# Altium schematic sheet AphelionGroundStation.SchDoc
size A4
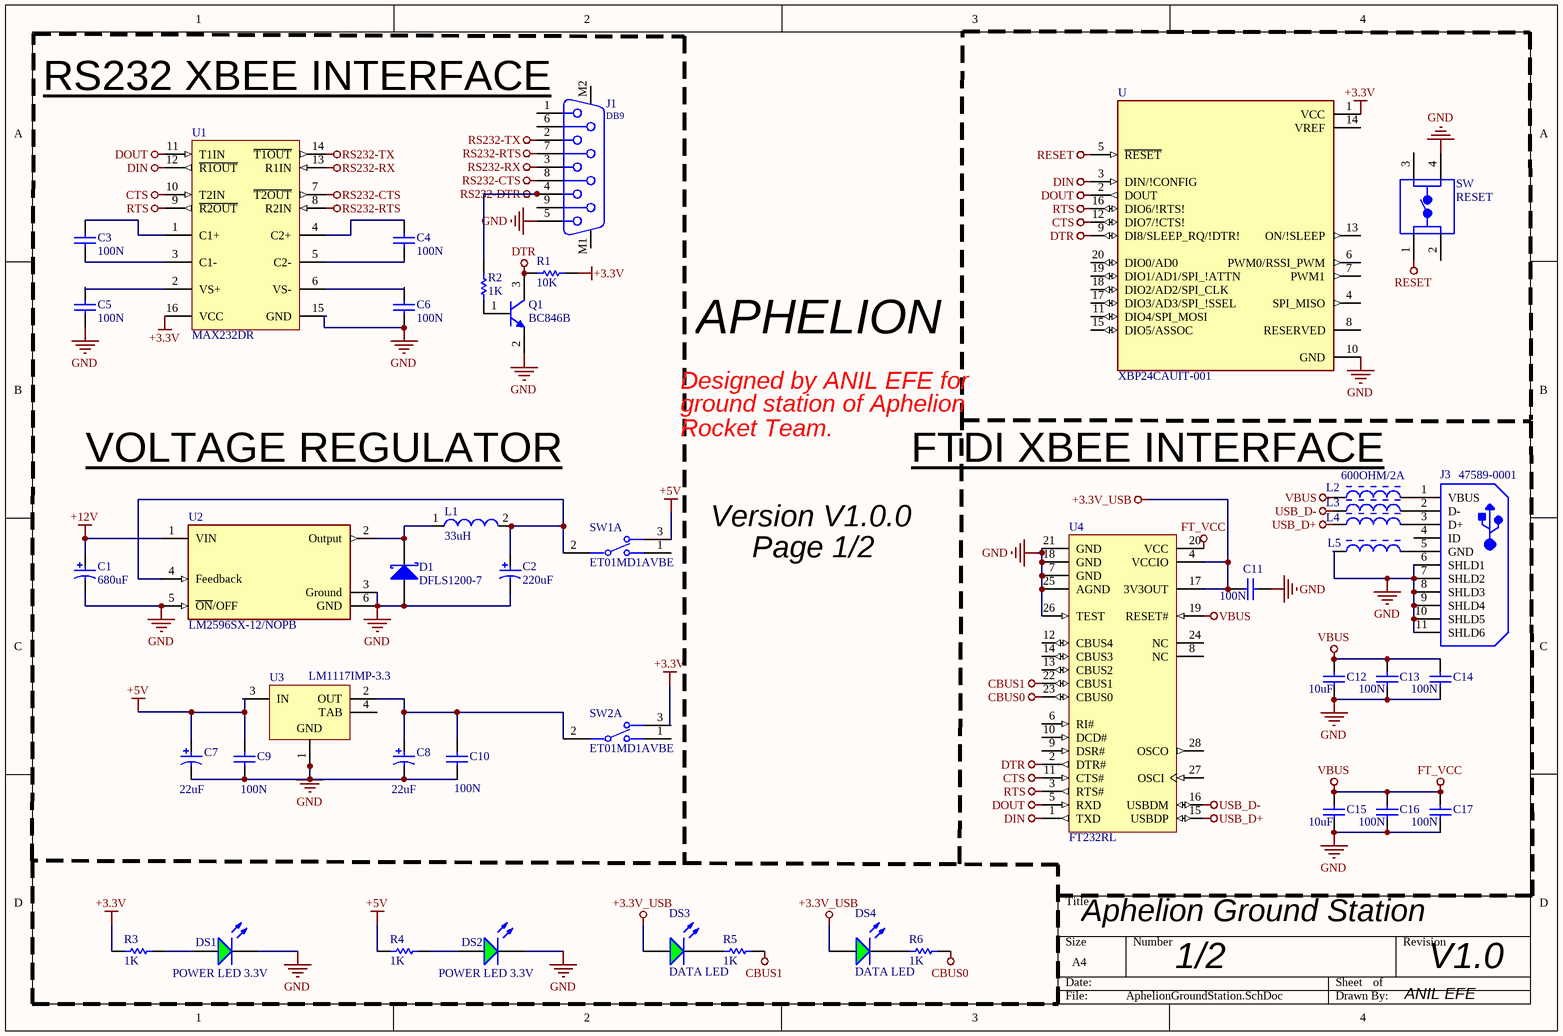
[diagram p0: AphelionGroundStation.SchDoc]

## Parts
C1  680uF  [PNSC-FT-V-G_V]
C2  220uF  [PNSC-FP-V-F_V]
C3  100N  [KEMT-1206-2_M]
C4  100N  [KEMT-1206-2_M]
C5  100N  [KEMT-1206-2_M]
C6  100N  [KEMT-1206-2_M]
C7  22uF  [KEMT-T491-D_L]
C8  22uF  [KEMT-T491-D_L]
C9  100N  [KEMT-1206-2_M]
C10  100N  [KEMT-1206-2_M]
C11  100N  [KEMT-1206-2_M]
C12  10uF  [KEMT-1206-2_M]
C13  100N  [KEMT-1206-2_M]
C14  100N  [KEMT-1206-2_M]
C15  10uF  [KEMT-1206-2_M]
C16  100N  [KEMT-1206-2_M]
C17  100N  [KEMT-1206-2_M]
D1  DFLS1200-7  [DIOD-POWERDI123-2_A_V]
DS1  POWER LED 3.3V  [KING-APTD3216CGCK_V]
DS2  POWER LED 3.3V  [KING-APTD3216CGCK_V]
DS3  DATA LED  [KING-APTD3216CGCK_V]
DS4  DATA LED  [KING-APTD3216CGCK_V]
J1  DB9  [618009231321]
J3  47589-0001  [MOLX-47589-0001_V]
L1  33uH  [WE-PD 1050]
L2  600OHM/2A  [MURA-BLM31A_L]
L3  600OHM/2A  [MURA-BLM31A_L]  (value not drawn)
L4  600OHM/2A  [MURA-BLM31A_L]  (value not drawn)
L5  600OHM/2A  [MURA-BLM31A_L]  (value not drawn)
Q1  BC846B  [ONSC-SOT-23-3-318-08_V]
R1  10K  [RESC3216X60X45LL10T20]
R2  1K  [RESC3216X60X45LL10T20]
R3  1K  [RESC3216X60X45LL10T20]
R4  1K  [RESC3216X60X45LL10T20]
R5  1K  [RESC3216X60X45LL10T20]
R6  1K  [RESC3216X60X45LL10T20]
SW  RESET  [TE_3-1825910-1]
SW1  ET01MD1AVBE  [FP-ET01MD1AVBE-MFG]  (part A of 2)
SW2  ET01MD1AVBE  [FP-ET01MD1AVBE-MFG]  (part A of 2)
U  XBP24CAUIT-001  [MODULE_XBP24CAUIT-001]
U1  MAX232DR  [D0016A_L]
U2  LM2596SX-12/NOPB  [FP-KTT0005B-MFG]
U3  LM1117IMP-3.3  [DCY0004A_N]
U4  FT232RL  [FTDI-SSOP-28_M]

## Nets
+3.3V: R1.2 R3.1 SW2.3 U.1(VCC) U1.16(VCC)
+3.3V_USB: C11.2 DS3.1(A) DS4.1(A) U4.4(VCCIO) U4.17(3V3OUT)
+5V: C7.1 C9.2 R4.1 SW1.3 U3.3(IN)
+12V: C1.1 U2.1(VIN)
CBUS0: R6.2 U4.23(CBUS0)
CBUS1: R5.2 U4.22(CBUS1)
CTS: U.12(DIO7/!CTS!) U1.10(T2IN) U4.11(CTS#)
DIN: U.3(DIN/!CONFIG) U1.12(~{R1OUT}) U4.1(TXD)
DOUT: U.2(DOUT) U1.11(T1IN) U4.5(RXD)
DTR: Q1.3(C) R1.1 U.9(DI8/SLEEP_RQ/!DTR!) U4.2(DTR#)
FT_VCC: C12.2 C13.2 C14.2 C15.2 C16.2 C17.2 L2.1 U4.19(RESET#) U4.20(VCC)  [also labelled VBUS]
GND: C1.2 C2.2 C5.2 C6.2 C7.2 C8.2 C9.1 C10.1 C11.1 C12.1 C13.1 C14.1 C15.1 C16.1 C17.1 D1.1(A) DS1.2(K) DS2.2(K) J1.5 J3.6(SHLD1) J3.7(SHLD2) J3.8(SHLD3) J3.9(SHLD4) J3.10(SHLD5) J3.11(SHLD6) L5.1 Q1.2(E) SW.4 U.10(GND) U1.15(GND) U2.3(Ground) U2.5(~{ON}/OFF) U2.6(GND) U3.1(GND) U4.7(GND) U4.18(GND) U4.21(GND) U4.25(AGND) U4.26(TEST)
RESET: SW.1 U.5(~{RESET})
RS232-CTS: J1.8 U1.7(~{T2OUT})
RS232-DTR: J1.4 R2.2
RS232-RTS: J1.7 U1.8(R2IN)
RS232-RX: J1.3 U1.13(R1IN)
RS232-TX: J1.2 U1.14(~{T1OUT})
RTS: U.16(DIO6/!RTS!) U1.9(~{R2OUT}) U4.3(RTS#)
USB_D+: L4.1 U4.15(USBDP)
USB_D-: L3.1 U4.16(USBDM)
NetC2_1: C2.1 L1.2 SW1.2(COM) U2.4(Feedback)
NetC3_1: C3.1 U1.3(C1-)
NetC3_2: C3.2 U1.1(C1+)
NetC4_1: C4.1 U1.5(C2-)
NetC4_2: C4.2 U1.4(C2+)
NetC5_1: C5.1 U1.2(VS+)
NetC6_1: C6.1 U1.6(VS-)
NetC8_1: C8.1 C10.2 SW2.2(COM) U3.2(OUT)
NetD1_2: D1.2(K) L1.1 U2.2(Output)
NetDS1_1: DS1.1(A) R3.2
NetDS2_1: DS2.1(A) R4.2
NetDS3_2: DS3.2(K) R5.1
NetDS4_2: DS4.2(K) R6.1
NetJ3_1: J3.1(VBUS) L2.2
NetJ3_2: J3.2(D-) L3.2
NetJ3_3: J3.3(D+) L4.2
NetJ3_5: J3.5(GND) L5.2
NetQ1_1: Q1.1(B) R2.1

Not connected (* = marked no-connect by the designer): J1 1 6 9 M1 M2; J3 4(ID); SW 2 3; SW1 1; SW2 1; U 4(SPI_MISO) 6(PWM0/RSSI_PWM) 7(PWM1) 8(RESERVED) 11(DIO4/SPI_MOSI) 13(ON/!SLEEP) 14(VREF) 15(DIO5/ASSOC) 17(DIO3/AD3/SPI_!SSEL) 18(DIO2/AD2/SPI_CLK) 19(DIO1/AD1/SPI_!ATTN) 20(DIO0/AD0); U3 4(TAB); U4 6(RI#) 8(NC) 9(DSR#) 10(DCD#) 12(CBUS4) 13(CBUS2) 14(CBUS3) 24(NC) 27(OSCI) 28(OSCO)

## Notes on the sheet
- RS232 XBEE INTERFACE
- APHELION
- Rocket Team.
- ground station of Aphelion
- Designed by ANIL EFE for
- VOLTAGE REGULATOR
- FTDI XBEE INTERFACE
- Version V1.0.0
- Page 1/2
- Aphelion Ground Station
- 1/2
- V1.0
- ANIL EFE

## Library data of the parts
C1 = CMP-2000-06218-1: Aluminum Electrolytic Capacitor, 560 uF, +/- 20%, 35 V, 2-Pin SMD (Size Code G), -55 to 105 degC, RoHS, Tape and Reel; Manufacturer: Panasonic; Rated Voltage: 35V; Ripple Current: 1190mA; ESR (Equivalent Series Resistance): 0.06O; Lifetime@Temperature: 2000Hrs@105°C; Capacitance: 560µF; Type: Can; Manufacturer URL: http://www.panasonic.com/; Package Reference: FT-V-G; Package URL: http://industrial.panasonic.com/cdbs/www-data/pdf/RDE0000/DME0000COL48.pdf; Datasheet Version: 03/2014; Mounting Technology: SurfaceMount; Operating Temp Range: -55to+105°C; Datasheet URL: http://industrial.panasonic.com/cdbs/www-data/pdf/RDE0000/ABA0000C35.pdf; Series: FT; Case Size/Dimension: Ø10x10.2mm; Operating Temp-Max: 105°C; Package Description: 2-Pin Electrolytic Aluminum Capacitor, Body 10.3 x 10.3 mm
C2 = CMP-2000-06215-1: Aluminum Electrolytic Capacitor, 220 uF, +/- 20%, 35 V, 2-Pin SMD (Size Code F), -55 to 105 degC, RoHS, Tape and Reel; Manufacturer: Panasonic; ESR: 0.08ohm; Ripple Current AC: 850mA; Capacitance: 220µF; External Length / Height: 10.2mm; SVHC: ToBeAdvised; Life Time @ Temperature: 2000hours@105°C; Voltage Rating: 35V; Capacitor Case Style: RadialCan-SMD; Leakage Current: 7.7µA; Product Range: PANASONIC-FPSeries; Diameter: 8mm; Datasheet URL: http://industrial.panasonic.com/cdbs/www-data/pdf/RDE0000/ABA0000C1184.pdf; Manufacturer URL: http://www.panasonic.com/; Series: FP; Operating Temperature Max: 105°C; Package Description: 2-Pin Electrolytic Aluminum Capacitor, Body 8.3 x 8.3 mm; Package Reference: FP-V-F; Lifetime @ Temperature: 2000hours@105°C; Operating Temperature Range: -55°Cto+105°C; Package URL: http://industrial.panasonic.com/cdbs/www-data/pdf/RDE0000/DME0000COL48.pdf; Capacitance Tolerance ±: ±20%; AE Capacitor Case: RadialCan-SMD; Height: 10.2mm; Mounting Technology: SurfaceMount; Datasheet Version: 03/2016; Packaging: CutTape; Operating Temperature Min: -55°C; Capacitance Tolerance: ±20%
C3-C6 C9-C17 = CMP-2000-05169-1: CAP, Ceramic, 0.1 uF, +/- 10%, 50 V, -55 to 125 degC, 1206 (3216 Metric), RoHS, Tape and Reel; Manufacturer: Kemet; Voltage Rating: 50V; Capacitance: 0.1µF; Product Range: KEMET-CSeries; SVHC: ToBeAdvised; Dielectric Characteristic: X7R; Capacitor Case Style: 1206[3216Metric]; Package Reference: 1206-2; Package Description: 2-Leads SMD, Body 3.2 x 1.6 mm; Packaging: Tape&Reel; Operating Temperature Max: 125degC; Capacitance Tolerance: ±10%; Datasheet URL: https://datasheet.ciiva.com/6125/1725438-6125494.pdf; Manufacturer URL: http://www.kemet.com/; Operating Temperature Min: -55degC; Datasheet Version: Jul-13
C7 C8 = CMP-2000-07201-1: Tantalum Surface Mount Capacitor, 22 uF, +/- 10%, 16 V, -55 to 125 degC, 2-Pin SMD, RoHS, Tape and Reel; Manufacturer: Kemet; Voltage Rating: 16V; ESR: 0.8ohm; Capacitance: 22µF; SVHC: –; Capacitor Case Style: 2917; Package Description: 2-Pin Surface Mount Device, Body 7.3 x 4.3 mm; Mounting Technology: SurfaceMount; Datasheet URL: http://www.kemet.com/Lists/ProductCatalog/Attachments/254/KEM_T2005_T491.pdf; Lead Spacing: –; Capacitor Terminals: SMD; Datasheet Version: 06/2016; Package Reference: T491-D; Manufacturer URL: http://www.kemet.com/; Capacitance Tolerance: ±10%; MSL: MSL1-Unlimited; Operating Temperature Range: -55°Cto+125°C
D1 = CMP-2000-07540-1: High Voltage Schottky Barrier Rectifier, 200 V, 1 A, -65 to 175 degC, 2-Pin SMD, RoHS, Tape and Reel; Manufacturer: Diodes Inc; Peak Non-Repetitive Surge Current: 40A; Max Repetitive Reverse Voltage (Vrrm): 200V; Peak Reverse Current: 2uA; Capacitance: 23pF; Forward Current: 1A; Forward Voltage: 850mV; Element Configuration: Single; Polarity: Standard; Number of Pins: 2; Package Description: 2-Pin Small Outline Diode, Body 2.8 x 1.78 mm; Mount: SurfaceMount; Max Operating Temperature: 150degC; Package Quantity: 3000; Lead Free: LeadFree; Max Forward Surge Current (Ifsm): 40A; Height: 0.98mm; Datasheet Version: Rev. 6-2, 10/2008; Package Reference: POWERDI123-2_A; Reverse Voltage (DC): 200V; REACH SVHC: NoSVHC; Min Operating Temperature: -65degC; RoHSCompliant: true; Width: 1.78mm; Contact Plating: Matte; Termination: SMD/SMT; Manufacturer URL: http://www.diodes.com/; Voltage Rating (DC): 200V; Length: 2.8mm; Output Current: 1A; Packaging: TapeandReel; Current Rating: 1A; Radiation Hardening: No; Mounting Technology: SurfaceMount; Average Rectified Current: 1A; Datasheet URL: https://www.diodes.com/assets/Datasheets/ds30628.pdf
DS1-DS4 = CMP-2000-05792-1: Chip LED Lamp, Green, 5 V, 30 mA, -40 to 85 degC, 2-Pin SMD, RoHS, Tape and Reel; Manufacturer: Kingbright; Wavelength - Dominant: 570nm; Online Catalog: 3.2mmx1.6mmRoundwithDomedTop1206PackageLEDs; Viewing Angle: 50°; Voltage - Forward (Vf) (Typ): 2.1V; Lens Type: Clear; Wavelength - Peak: 574nm; Other Names: 754-1152-2; 3D Model: APTD3216x.sldprt / APTD3216x.pro / APTD3216x.igs / APTD3216x.stp; Catalog Drawings: APTD3216SeriesTop / APTD3216SeriesSide; Current - Test: 20mA; Millicandela Rating: 300mcd; Lens Style/Size: RoundwithDomedTop,1.6mm; Standard Package: 2,000; Datasheet URL: https://www.kingbrightusa.com/images/catalog/spec/APTD3216CGCK.pdf; Family: LEDIndication-Discrete; Category: Optoelectronics; Package Reference: APTD3216CGCK; Datasheet Version: Rev. V.17B, 04/2015; Package / Case: 1206(3216Metric); Mounting Technology: SurfaceMount; Color: Green; Packaging: Tape&Reel(TR); Manufacturer URL: http://www.kingbright.com/; Height: 1.80mm; Package Description: 2-Pin Surface Mount Device, Body 3.2 x 1.6 mm; Mounting Type: SurfaceMount; Size / Dimension: 3.20mmLx1.60mmW
J1 = CMP-1502-00204-1: Female PCB Connector with Hex Screw WR-DSUB, 10.30 mm, Angled, 9 pins; Manufacturer: Wurth Elektronik; Working Voltage: 125VAC; Rated Current: 3A; Contact Resistance: 30mOhm; Pin Number: 9; Gender: Female; Operating Temperature: -40to85degC; Part Number: 618009231321; Packaging: Tray; Manufacturer URL: http://www.we-online.de; Publisher: WurthElektronik; Orientation: Angled; Datasheet URL: https://katalog.we-online.de/em/datasheet/6180xx231321.pdf; Package Reference: 618009231321; Mounting Technology: THT
J3 = CMP-2000-05610-1: Right Angle Female Type AB Micro USB Connector, 30 V, 1.8 A, -30 to 85 degC, RoHS, Tape and Reel; Number of Ports: 1Port; Current Rating: 1.8A; Brand: Molex; Connector Type: MicroUSBTypeABreceptacle; Number of Contacts: 5Contact; Voltage Rating: 30VAC; Color: Black; Product: MicroUSBTypeABConnectors; Package URL: http://www.molex.com/pdm_docs/sd/475890001_sd.pdf; Contact Plating: Gold; Datasheet URL: http://www.molex.com/webdocs/datasheets/pdf/en-us/0475890001_IO_CONNECTORS.pdf; Operating Temperature Range: -20Cto+85C; Termination Style: SMD/SMT; Mounting Angle: Right; Package Reference: 47589-0001; Gender: Female; Package Description: Micro USB Connector, Pitch 0.65 mm, 5 Positions, Body 7.5 x 5.6 mm; Mounting Technology: SurfaceMount; Contact Material: CopperAlloy; Packaging: Reel; RoHS: True; Standard: USB; Manufacturer URL: http://www.molex.com/; Manufacturer: Molex; Datasheet Version: 12/2016; Product Category: USBConnectors; Series: 47589
L1 = CMP-1396-00022-1: SMD-Shielded Power Inductor WE-PD, L=33.0 µH; PartNumber: 7447714330; Manufacturer: Wuerth Elektronik; Inductance: 33.0 ÂµH; ComponentLink2Description: Datasheet; ComponentLink1URL: http://www.we-online.com; PackageReference: WE-PD 1050; ComponentLink1Description: Manufacturer URL; ComponentLink2URL: http://www.we-online.de/katalog/media/pdf/7447714330.pdf
L2-L5 = CMP-2000-05955-1: Chip Bead, 100 MHz, 200 mA, -55 to 125 degC, 2-Pin SMD (1206), RoHS, Tape and Reel; Manufacturer: Murata; Brand: MurataElectronics; Case Height: 1.1mm; Maximum DC Resistance: 150mOhms; Case Length: 3.2mm; Maximum DC Current: 200mA; Tolerance: 25%; Case Width: 1.6mm; Impedance: 70Ohms; Test Frequency: 100MHz; Product Category: EMIFilterBeads,Chips&Arrays; Series: BLM31A; Manufacturer URL: http://www.murata.com/; Mounting Technology: SurfaceMount; Package / Case: 1206(3216metric); Product: FerriteChipBeads; Package Reference: 1206; Packaging: Reel; Dimensions: 1.6mmWx3.2mmLx1.1mmH; Operating Temperature Range: -55Cto+125C; RoHS: Details; Package Description: 2-Pin Surface Mount Device, Body 3.2 x 1.6 mm; Termination Style: SMD/SMT; Datasheet URL: http://www.mouser.com/ds/2/281/L0110S0100BLM31A_SP-767397.pdf; Datasheet Version: 11/2007; Factory Pack Quantity: 2500
Q1 = CMP-1048-00779-1: General Purpose Transistor, NPN Silicon, 3-Pin SOT-23, Pb-Free, Tape and Reel; PartNumber: BC846BLT1G; Manufacturer: On Semiconductor; fT Min (MHz): 100; IC Continuous (A): 0.1; Mounting Technology: Surface Mount; ComponentLink1Description: Manufacturer URL; ComponentLink2Description: Datasheet; Polarity: NPN; ComponentLink3URL: http://www.onsemi.cn/pub_link/Collateral/318-08.PDF; DatasheetVersion: Rev. 11; ComponentLink3Description: Package Specification; RoHS: TRUE; PackageDescription: 3-Pin Small Outline Transistor, Body 2.92 x 1.3 mm, Pitch 0.95 mm; PackageReference: SOT-23-3-318-08; ComponentLink2URL: http://www.onsemi.cn/pub_link/Collateral/BC846ALT1-D.PDF; PackageVersion: Rev. AP, 11/2009; ComponentLink1URL: http://www.onsemi.com/; Packing: Tape and Reel
R1-R6 = CMP-2003-02243-1: Manufacturer: Vishay Dale; Part Number: CRCW12064M70FKEA
SW = 3-1825910-1: Switch Push Button OFF _ON_ SPST Round Button 0.05A 24VDC Momentary Contact PC Pins Thru-Hole; MF: TE Connectivity; Availability: Unavailable; SnapEDA_Link: https://www.snapeda.com/parts/3-1825910-1/TE%20Connectivity%20ALCOSWITCH%20Switches/view-part/452461/?ref=snap; Price: None; EU_RoHS_Compliance: Compliant; Package: None; TE_purchase_URL: https://www.te.com/usa-en/product-3-1825910-1.html?te_bu=Cor&te_type=disp&te_campaign=seda_glo_cor-seda-global-disp-prtnr-fy19-seda-model-bom-cta_sma-317_1&elqCampaignId=32493; MP: 3-1825910-1; Value: *
SW1 SW2 = CMP-10041-000001-1: SWITCH TOGGLE SPDT 0.4VA 20V; Manufacturer: C&K Components; Electromechanical Life: 60000Cycles; Contact Resistance: 20mΩ; Standoff Height: 0.64mm; Automotive: No; RoHS: TRUE; Temperature: -30°C to +85°C; ComponentLink2Description: Datasheet; Temperature Range High: +85°C; Category: Switch; Throw Configuration: SPDT; Device Class L2: Switches; Mouser Description: Toggle Switches ON-ON SPDT R/A PCB; Lead Free: Yes; Voltage Rating Dc: 20V; Octopart: https://octopart.com/et01md1avbe-c%26k+components-2490750; Manufacturer Part Number: ET01MD1AVBE; Mount: Through Hole; ComponentLink2URL: https://www.ckswitches.com/media/1387/ettoggle.pdf; Height: 8.77mm; Voltage Rating Ac: 20V; Digikey Description: SWITCH TOGGLE SPDT 0.4VA 20V; Device Class L1: Electromechanical; Package: ET01MD1AVBE; Device Class L3: Toggle Switches; Temperature Range Low: -30°C
U = XBP24CAUIT-001: 802.15.4 Transceiver Module 2.4GHz Antenna Not Included, U.FL Through Hole; MF: Digi International; Price: None; SnapEDA_Link: https://www.snapeda.com/parts/XBP24CAUIT-001/Digi%20International/view-part/1219456/?ref=snap; MP: XBP24CAUIT-001; Value: *; Availability: Unavailable; Package: Module Digi International
U1 = CMP-0299-00150-2: Dual EIA-232 Driver / Receiver, 0 to 70 degC, 16-Pin SOIC (D), Green (RoHS & no Sb/Br); Single Supply: TRUE; Supply Voltage(s)(V): 5; SubFamily: RS-232; Drivers Per Package: 2; ICC(Max)(mA): 10; ESD HBM(kV): +/-2; ComponentLink1Description: Manufacturer URL; ComponentLink2Description: Datasheet; RS-232: TRUE; ComponentLink3URL: http://www.ti.com/litv/pdf/mpds178g; DatasheetVersion: SLLS047L; ComponentLink1URL: www.ti.com; PackageDescription: 16-Pin Plastic Small Outline Integrated Circuit, 9.9 x 3.9 mm, Pitch 1.27 mm Pitch; PackageVersion: revM, Jun-2011; ComponentLink2URL: http://www.ti.com/general/docs/lit/getliterature.tsp?genericPartNumber=MAX232&fileType=pdf; ComponentLink3Description: Package Specification; PackageReference: D0016A; Receivers Per Package: 2
U2 = CMP-04918-000013-1: IC REG BUCK 12V 3A TO263-5; Manufacturer: Texas Instruments; Max Duty Cycle: 100%; Max Junction Temp: +150°C; Min Supply Voltage: 4.5V; Max Supply Voltage: 40V; Standoff Height: 0mm; Switching Frequency: 150kHz; Nominal Supply Current: 5mA; Number Of Outputs: 1; Output Type: Fixed; Device Class L1: Integrated Circuits (ICs); ComponentLink2Description: Datasheet; Height: 4.8mm; Switching Topology: Buck; Device Class L2: Power Management ICs; Temperature Range Low: -40°C; Output Voltage: 12V; Lead Free: Yes; Digikey Description: IC REG BUCK 12V 3A TO263-5; Device Class L3: Voltage Regulators - Switching; Manufacturer Part Number: LM2596SX-12/NOPB; Octopart: https://octopart.com/lm2596sx-12%2Fnopb-texas+instruments-24812942; Mouser Description: SIMPLE SWITCHER® 4.5V to 40V, 3A Low Component Count Step-Down Regulator 5-DDPAK/TO-263; Package: KTT0005B; Output Current: 3A; Automotive: No; Temperature: -40°C to +125°C; RoHS: TRUE; Temperature Range High: +125°C; Category: IC; ComponentLink2URL: http://www.ti.com/lit/ds/symlink/lm2596.pdf
U3 = CMP-0062-01631-4: 800mA Low-Dropout Linear Regulator, 4-pin SOT-223, Pb-Free; PartNumber: LM1117IMP-3.3/NOPB; Manufacturer: Texas Instruments; PackageTopMarking: XYTT*N05B; PowerWise: N; High-Reliability: Y; CompType: LDO IC; Code_IPC: SOT223-4; PackageReference: DCY0004A; PinCount: 4; PackageDescription: Molded SOT-223, 6.50 x 3.56 x 1.6mm Body, 4 Lead, 2.3mm Pitch; RoHS: Y; ComponentLink1Description: Datasheet URL; Code_JEDEC: TO-261-AA; ComponentLink1URL: http://www.ti.com/general/docs/lit/getliterature.tsp?genericPartNumber=LM1117-N&fileType=pdf
U4 = CMP-2000-05029-1: IC USB FS SERIAL UART 28-SSOP; Manufacturer: FTDI; Receive FIFO: 256B; Number of Channels per Chip: 1; Maximum Data Rate: 3MBd; Transmit FIFO: 128B; Dimensions: 10.2x5.3x1.75mm; Mounting Type: SurfaceMount; Height: 1.75mm; Package Type: SSOP; Datasheet Version: Rev. 1.04, 02/2006; Width: 5.3mm; Manufacturer URL: http://www.ftdichip.com/; Datasheet URL: http://datasheet.octopart.com/FT232RL-FTDI-datasheet-120501.pdf; Maximum Operating Temperature: +85degC; Minimum Operating Temperature: -40degC; Pin Count: 28; Length: 10.2mm